# Altium schematic sheet PT2399.SchDoc
size A4
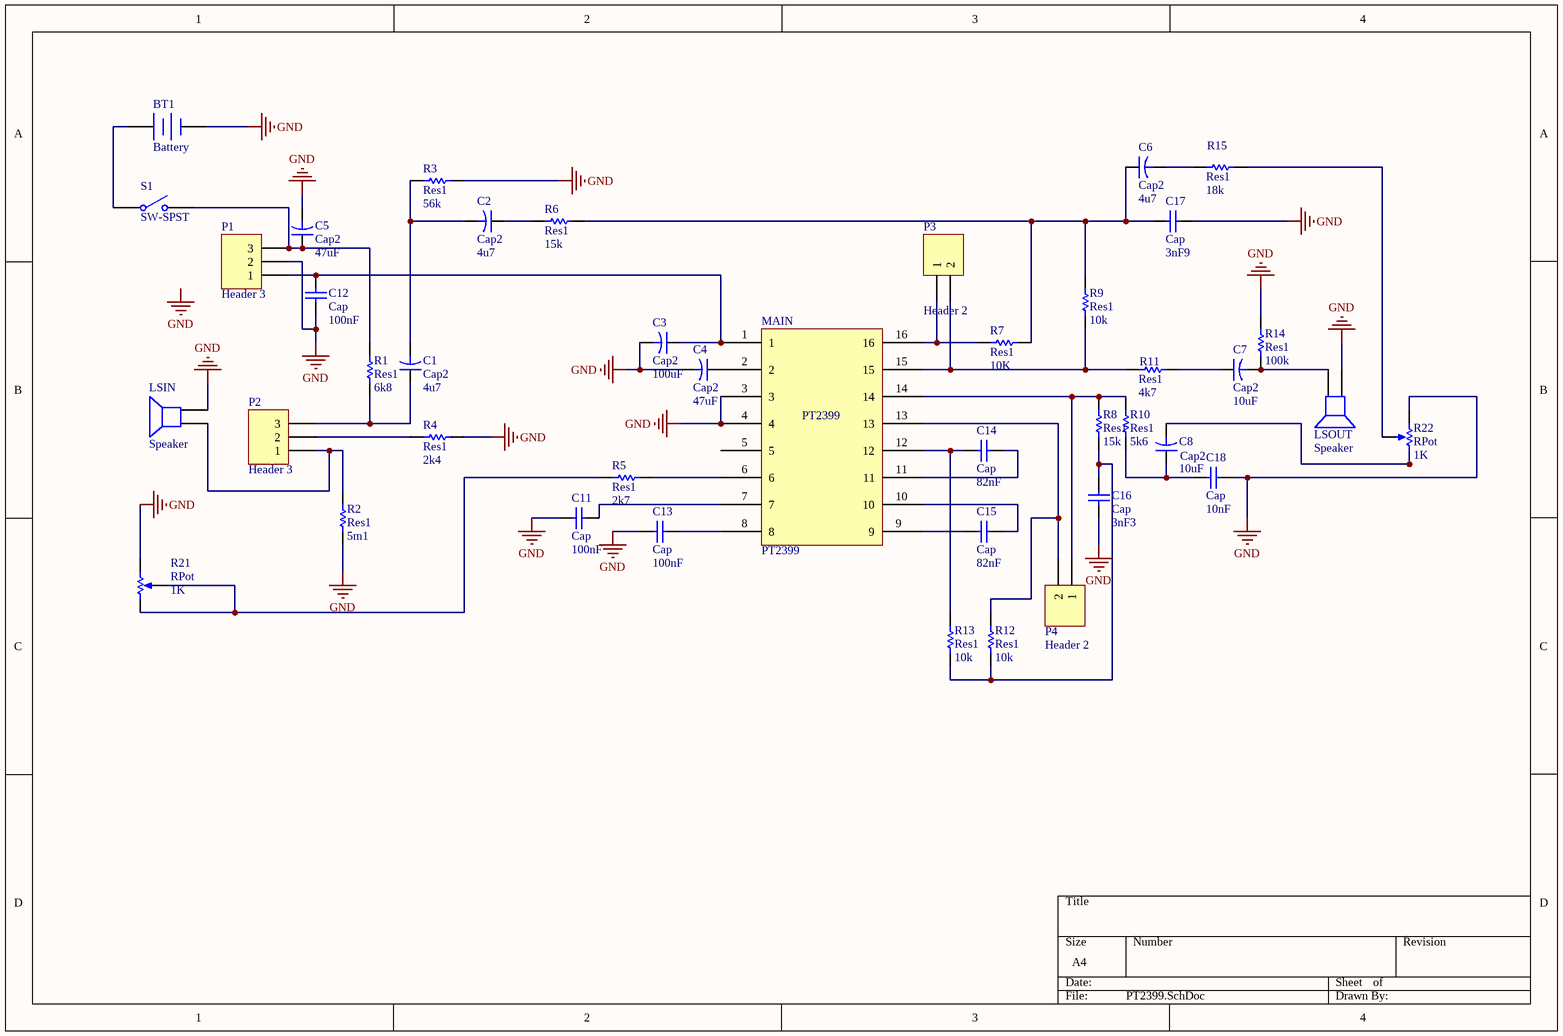
[diagram p0: PT2399.SchDoc]

## Parts
BT1  Battery  [BAT-2]
C1  Cap2  value 4u7  [CAPR5-4X5]
C2  Cap2  value 4u7  [CAPR5-4X5]
C3  Cap2  value 100uF  [CAPR5-4X5]
C4  Cap2  value 47uF  [CAPR5-4X5]
C5  Cap2  value 47uF  [CAPR5-4X5]
C6  Cap2  value 4u7  [CAPR5-4X5]
C7  Cap2  value 10uF  [CAPR5-4X5]
C8  Cap2  value 10uF  [CAPR5-4X5]
C11  Cap  value 100nF  [RAD-0.3]
C12  Cap  value 100nF  [RAD-0.3]
C13  Cap  value 100nF  [RAD-0.3]
C14  Cap  value 82nF  [RAD-0.3]
C15  Cap  value 82nF  [RAD-0.3]
C16  Cap  value 3nF3  [RAD-0.3]
C17  Cap  value 3nF9  [RAD-0.3]
C18  Cap  value 10nF  [RAD-0.3]
LSIN  Speaker  [PIN2]
LSOUT  Speaker  [PIN2]
MAIN  PT2399  [PT2399]
P1  Header 3  [HDR1X3]
P2  Header 3  [HDR1X3]
P3  Header 2  [HDR1X2]
P4  Header 2  [HDR1X2]
R1  Res1  value 6k8  [AXIAL-0.3]
R2  Res1  value 5m1  [AXIAL-0.3]
R3  Res1  value 56k  [AXIAL-0.3]
R4  Res1  value 2k4  [AXIAL-0.3]
R5  Res1  value 2k7  [AXIAL-0.3]
R6  Res1  value 15k  [AXIAL-0.3]
R7  Res1  value 10K  [AXIAL-0.3]
R8  Res1  value 15k  [AXIAL-0.3]
R9  Res1  value 10k  [AXIAL-0.3]
R10  Res1  value 5k6  [AXIAL-0.3]
R11  Res1  value 4k7  [AXIAL-0.3]
R12  Res1  value 10k  [AXIAL-0.3]
R13  Res1  value 10k  [AXIAL-0.3]
R14  Res1  value 100k  [AXIAL-0.3]
R15  Res1  value 18k  [AXIAL-0.3]
R21  RPot  value 1K  [7805]
R22  RPot  value 1K  [7805]
S1  SW-SPST  [SPST-2]

## Nets
GND: BT1.2(-) C3.2 C4.2 C5.2 C11.1 C12.1 C13.1 C16.1 C17.1 C18.2 LSIN.2 LSOUT.1 MAIN.3 MAIN.4 P1.2 R2.1 R3.1 R4.2 R14.2 R21.2(BOT) R22.1(TOP)
NetBT1_1: BT1.1(+) S1.1(COMMON)
NetC1_1: C1.1 P2.3 R1.1
NetC1_2: C1.2 C2.2 R3.2
NetC2_1: C2.1 R6.1
NetC3_1: C3.1 C12.2 MAIN.1 P1.1
NetC4_1: C4.1 MAIN.2
NetC5_1: C5.1 P1.3 R1.2 S1.2(NO)
NetC6_1: C6.1 C17.2 R6.2 R7.2 R9.2
NetC6_2: C6.2 R15.1
NetC7_1: C7.1 R11.2
NetC7_2: C7.2 LSOUT.2 R14.1
NetC8_1: C8.1 C18.1 R10.1
NetC8_2: C8.2 R22.2(BOT)
NetC11_2: C11.2 MAIN.7
NetC13_2: C13.2 MAIN.8
NetC14_1: C14.1 MAIN.12 R13.2
NetC14_2: C14.2 MAIN.11
NetC15_1: C15.1 MAIN.9
NetC15_2: C15.2 MAIN.10
NetC16_2: C16.2 R8.1 R12.2 R13.1
NetLSIN_1: LSIN.1 P2.1 R2.2
NetMAIN_6: MAIN.6 R5.1
NetMAIN_13: MAIN.13 P4.2 R12.1
NetMAIN_14: MAIN.14 P4.1 R8.2 R10.2
NetMAIN_15: MAIN.15 P3.2 R9.1 R11.1
NetMAIN_16: MAIN.16 P3.1 R7.1
NetP2_2: P2.2 R4.1
NetR5_2: R5.2 R21.1(TOP) R21.3(TAP)
NetR15_2: R15.2 R22.3(TAP)

Not connected (* = marked no-connect by the designer): MAIN 5

## Notes on the sheet
- Labels drawn without touching a wire or pin: GND

## Library data of the parts
BT1 = Battery: Multicell Battery; Published: 24-Mar-1999; LatestRevisionDate: 17-Jul-2002; LatestRevisionNote: Re-released for DXP Platform.; PackageReference: BAT-2; Publisher: Altium Limited; PackageDescription: Battery; 2 Leads
C1-C8 = Cap2: Capacitor; Published: 23-Sep-2002; PackageReference: CAPR5-4X5; Publisher: Altium Limited; PackageDescription: Capacitor; 2 Leads
C11-C18 = Cap: Capacitor; Published: 8-Jun-2000; LatestRevisionDate: 17-Jul-2002; LatestRevisionNote: Re-released for DXP Platform.; PackageReference: RAD-0.3; Publisher: Altium Limited; PackageDescription: Radial Cap, Thru-Hole; 2 Leads; 0.3 in Pin Spacing
LSIN LSOUT = Speaker: Loudspeaker; Published: 24-Mar-1999; LatestRevisionDate: 17-Jul-2002; LatestRevisionNote: Re-released for DXP Platform.; PackageReference: PIN2; Publisher: Altium Limited
P1 P2 = Header 3: Header, 3-Pin; LatestRevisionDate: 17-Jul-2002; LatestRevisionNote: Re-released for DXP Platform.; Publisher: Altium Limited
P3 P4 = Header 2: Header, 2-Pin; LatestRevisionDate: 17-Jul-2002; LatestRevisionNote: Re-released for DXP Platform.; Publisher: Altium Limited
R1-R15 = Res1: Resistor; Published: 8-Jun-2000; LatestRevisionDate: 17-Jul-2002; LatestRevisionNote: Re-released for DXP Platform.; PackageReference: AXIAL-0.3; Publisher: Altium Limited; PackageDescription: Axial Device, Thru-Hole; 2 Leads; 0.3 in Pin Spacing
R21 R22 = RPot: Potentiometer; Sim Note: Enter the Resistance value and the set point into parameter fields.; Set Position: 0.5; Published: 8-Jun-2000; LatestRevisionDate: 17-Jul-2002; LatestRevisionNote: Re-released for DXP Platform.; PackageReference: VR5; Publisher: Altium Limited; PackageDescription: Variable Resistor, Thru-Hole; 3 Leads
S1 = SW-SPST: Single-Pole, Single-Throw Switch; Published: 24-Mar-1999; LatestRevisionDate: 17-Jul-2002; LatestRevisionNote: Re-released for DXP Platform.; PackageReference: SPST-2; Publisher: Altium Limited; PackageDescription: Switch; 2 Leads